# EAGLE design main (EAGLE 6.2)
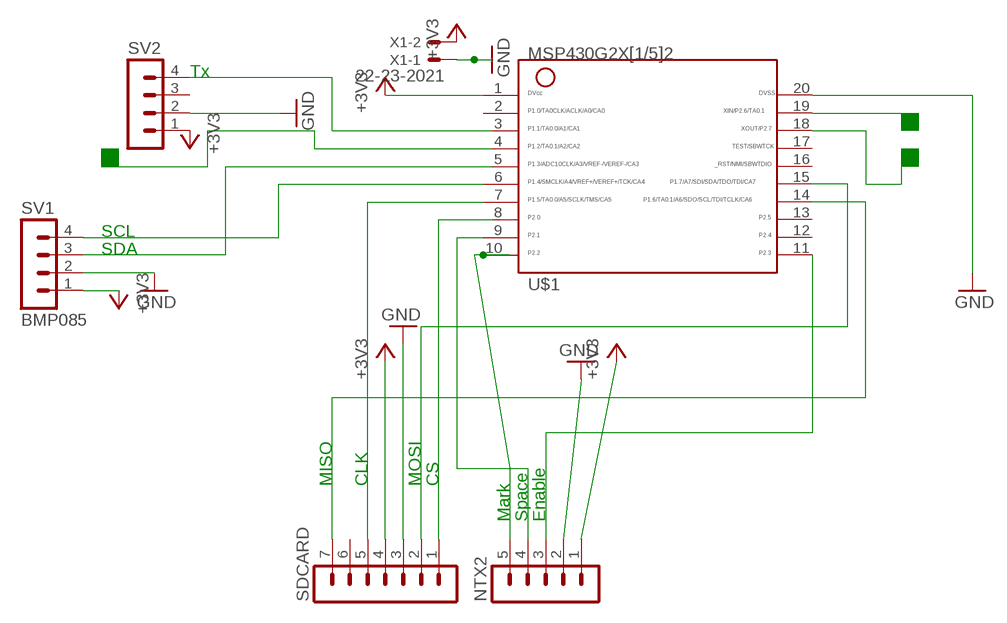
[diagram p0: schematic, sheet 1]

## Parts
NTX2  MA05-1  [MA05-1]
SDCARD  MA07-1  [MA07-1]
SV1  BMP085  MA04-1  [MA04-1]
SV2  MA04-1  [MA04-1]
U$1  G2X[1/5]2---N20  [N20]
X1  22-23-2021  [22-23-2021]

## Nets
+3V3: NTX2.1 SDCARD.4 SV1.1 SV2.1 U$1.1 X1.2
GND: NTX2.2 SDCARD.3 SV1.2 SV2.2 U$1.20 X1.1
N$1: SV1.4 U$1.6
N$2: SV1.3 U$1.5
N$3: SDCARD.1 U$1.8
N$4: SDCARD.2 U$1.15
N$5: SDCARD.5 U$1.7
N$6: SDCARD.7 U$1.14
N$7: SV2.4 U$1.3
N$8: NTX2.5 U$1.10
N$9: NTX2.3 U$1.11
N$10: U$1.19
N$11: NTX2.4 U$1.9
N$12: U$1.18
Unconnected: SDCARD.6 SV2.3 U$1.2 U$1.4 U$1.12 U$1.13 U$1.16 U$1.17

## Notes on the sheet
- Tx
- SCL
- SDA
- MISO | CLK | MOSI | CS
- Mark | Space | Enable

## Library data of the parts
NTX2 = con-lstb:MA05-1: PIN HEADER; OC_FARNELL: unknown; OC_NEWARK: unknown
SDCARD = con-lstb:MA07-1: PIN HEADER; OC_FARNELL: unknown; OC_NEWARK: unknown
SV1 SV2 = con-lstb:MA04-1: PIN HEADER; OC_FARNELL: unknown; OC_NEWARK: unknown
U$1 = TI_MSP430_v16:G2X[1/5]2---N20: MSP430G2X[1/5]2 MSP430G2x52, MSP430G2x12 PDIP (N) 20 Pin Package http://focus.ti.com/docs/prod/folders/print/msp430g2452.html
X1 = con-molex:22-23-2021: .100" (2.54mm) Center Header - 2 Pin; MF: MOLEX; MPN: 22-23-2021; OC_FARNELL: 1462926; OC_NEWARK: 25C3832

## Board
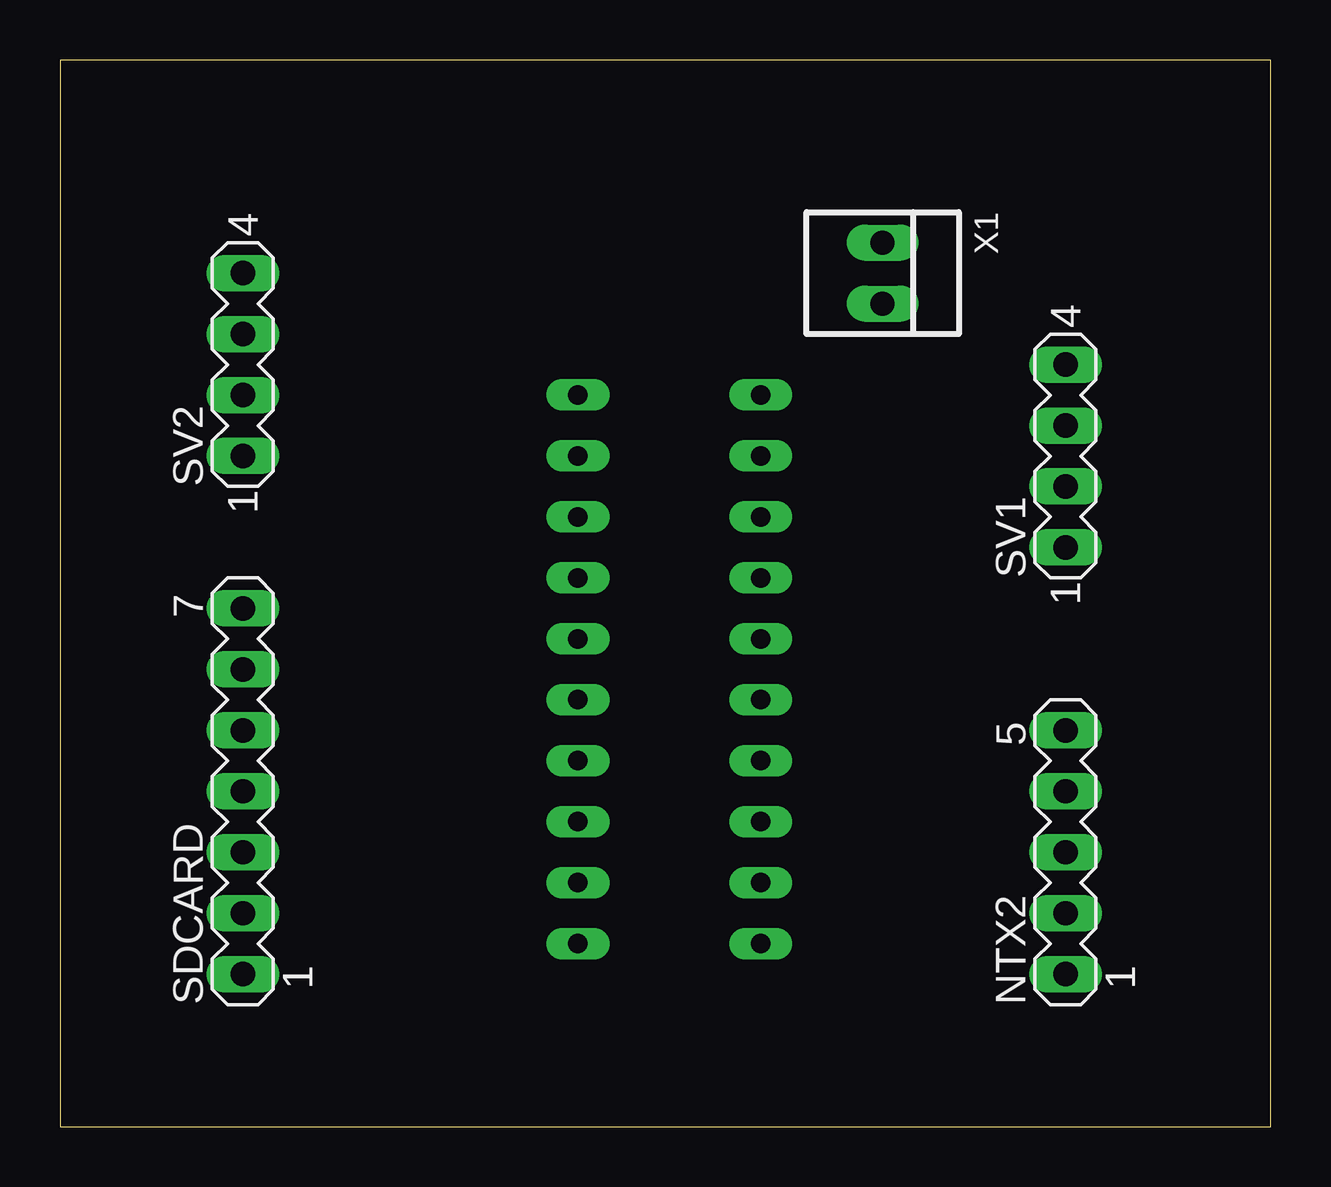
[diagram p1: board, top side]
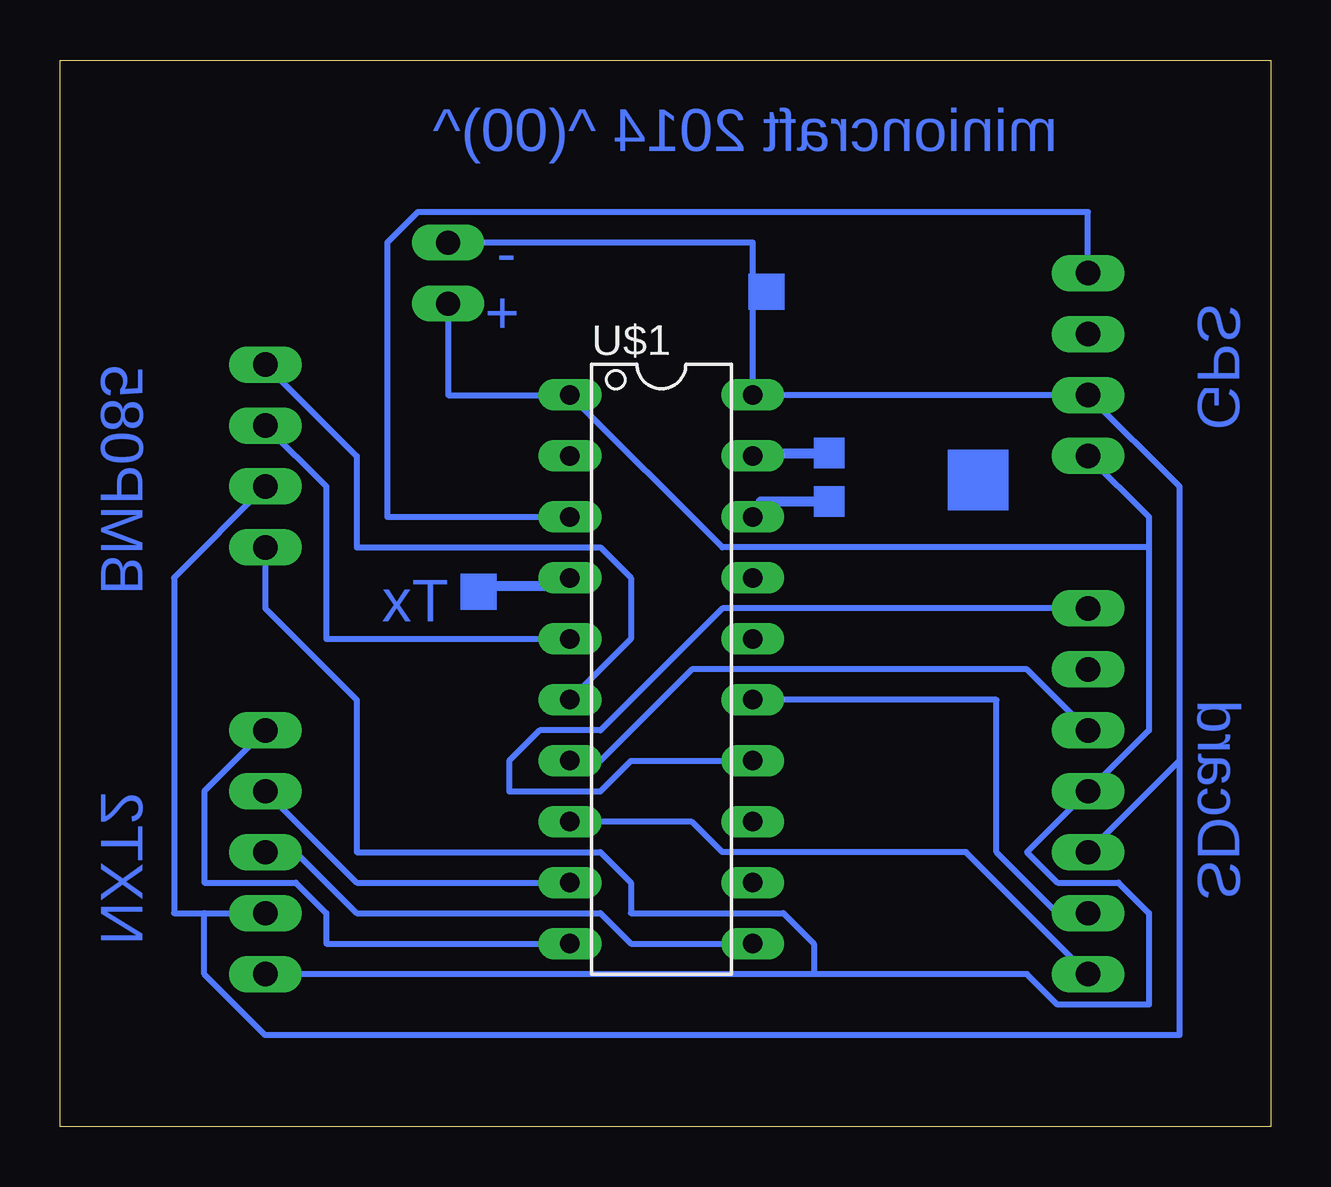
[diagram p2: board, bottom side, seen from below]

Size 50.47 x 44.44 mm. Coordinates in mm from the lower left corner, seen from the top.
Outline: 0,0 50.47,0 50.47,44.44 0,44.44 0,0
Copper layers (1*16): Top 0.035mm / dielectric 1.5mm / Bottom 0.035mm
Design rules "default": minimum track width 10mil, minimum drill 24mil, track to track 8mil, track to pad 8mil, pad to pad 8mil, via to via 8mil, smd to smd 8mil, copper to edge 40mil, drill to drill 8mil, minimum pad ring 10mil, minimum via ring 8mil, stop-mask expansion 4mil, vias tented up to drill 0mil, thermal gap 10mil

### Footprints (pad centres in the part's own frame; a part is rotated, then mirrored left to right if it is on the bottom)
MA05-1 = drill 1.016 long: 1 -5.08,0; 2 -2.54,0; 3 0,0; 4 2.54,0; 5 5.08,0
MA07-1 = drill 1.016 long: 1 -7.62,0; 2 -5.08,0; 3 -2.54,0; 4 0,0; 5 2.54,0; 6 5.08,0; 7 7.62,0
MA04-1 = drill 1.016 long: 1 -3.81,0; 2 -1.27,0; 3 1.27,0; 4 3.81,0
N20 = drill 0.813 long: 1 -11.435,-3.81; 2 -8.895,-3.81; 3 -6.355,-3.81; 4 -3.815,-3.81; 5 -1.275,-3.81; 6 1.265,-3.81; 7 3.805,-3.81; 8 6.345,-3.81; 9 8.885,-3.81; 10 11.425,-3.81; 11 11.425,3.81; 12 8.885,3.81; 13 6.345,3.81; 14 3.805,3.81; 15 1.265,3.81; 16 -1.275,3.81; 17 -3.815,3.81; 18 -6.355,3.81; 19 -8.895,3.81; 20 -11.435,3.81
22-23-2021 = drill 1 long: 1 -1.27,0; 2 1.27,0

### Placement (x,y rotation side)
NTX2  41.91,11.43 90 top
SDCARD  7.62,13.97 90 top
SV1  41.91,27.94 90 top
SV2  7.62,31.75 90 top
U$1  25.4,19.05 270 bottom
X1  34.29,35.56 270 top

### Tracks (layer width: path | path; a pad name or v marks a point on that pad's centre or on a via)
+3V3
  Bottom 0.254: 19.05,6.35 NTX2.1 | 19.05,6.35 19.05,7.62 20.32,8.89 26.67,8.89 26.67,10.16 27.94,11.43 38.1,11.43 38.1,17.78 41.91,21.59 SV1.1 | U$1.1 34.29,30.48 X1.2 | 5.08,24.13 5.08,25.4 SV2.1 | 5.08,24.13 5.08,16.51 SDCARD.4 10.16,11.43 8.89,10.16 6.35,10.16 5.08,8.89 5.08,5.08 8.89,5.08 10.16,6.35 19.05,6.35 | U$1.1 22.86,24.13 5.08,24.13 | U$1.1
GND
  Bottom 0.254: 44.45,8.89 45.72,8.89 45.72,22.86 SV1.2 | 44.45,8.89 NTX2.2 | X1.1 21.59,36.83 U$1.20 SV2.2 3.81,26.67 3.81,15.24 | 3.81,15.24 SDCARD.3 | 44.45,8.89 44.45,6.35 41.91,3.81 3.81,3.81 3.81,15.24
N$1
  Bottom 0.254: SV1.4 38.1,27.94 38.1,24.13 27.94,24.13 26.67,22.86 26.67,20.32 U$1.6
N$2
  Bottom 0.254: SV1.3 39.37,26.67 39.37,20.32 U$1.5
N$3
  Bottom 0.254: SDCARD.1 12.7,11.43 22.86,11.43 24.13,12.7 U$1.8
N$4
  Bottom 0.254: SDCARD.2 8.89,8.89 11.43,11.43 11.43,17.78 U$1.15
N$5
  Bottom 0.254: SDCARD.5 10.16,19.05 24.13,19.05 27.94,15.24 U$1.7
N$6
  Bottom 0.254: SDCARD.7 22.86,21.59 27.94,16.51 30.48,16.51 31.75,15.24 31.75,13.97 27.94,13.97 26.67,15.24 U$1.14
N$7
  Bottom 0.254: SV2.4 7.62,38.1 35.56,38.1 36.83,36.83 36.83,25.4 U$1.3
N$8
  Bottom 0.254: NTX2.5 44.45,13.97 44.45,10.16 40.64,10.16 39.37,8.89 39.37,7.62 U$1.10
N$9
  Bottom 0.254: NTX2.3 40.64,11.43 38.1,8.89 27.94,8.89 26.67,7.62 U$1.11
N$10
  Bottom 0.254: U$1.19
N$11
  Bottom 0.254: NTX2.4 38.1,10.16 U$1.9
N$13
  Bottom 0.406: 18.27,28.04 21.77,28.04
N$14
  Bottom 0.406: 32.77,22.54 29.77,22.54 29.27,23.04
N$15
  Bottom 0.406: 18.77,26.04 21.27,26.04 21.27,25.54
(copper drawn outside any net)
  shapes: Bottom area x5

### Text on the board
Bottom: minioncraft 2014 ^(00)^ | - | GPS | + | BMP085 | Tx | SDcard | NXT2